# EasyEDA schematic SCH_firebase_esp8266_2024-04-16.json
TITLE: Sheet_1; REV: 1.0; Date: 2024-04-16; Sheet: 1/1; Drawn By: Trường Lê; Company: Your Company
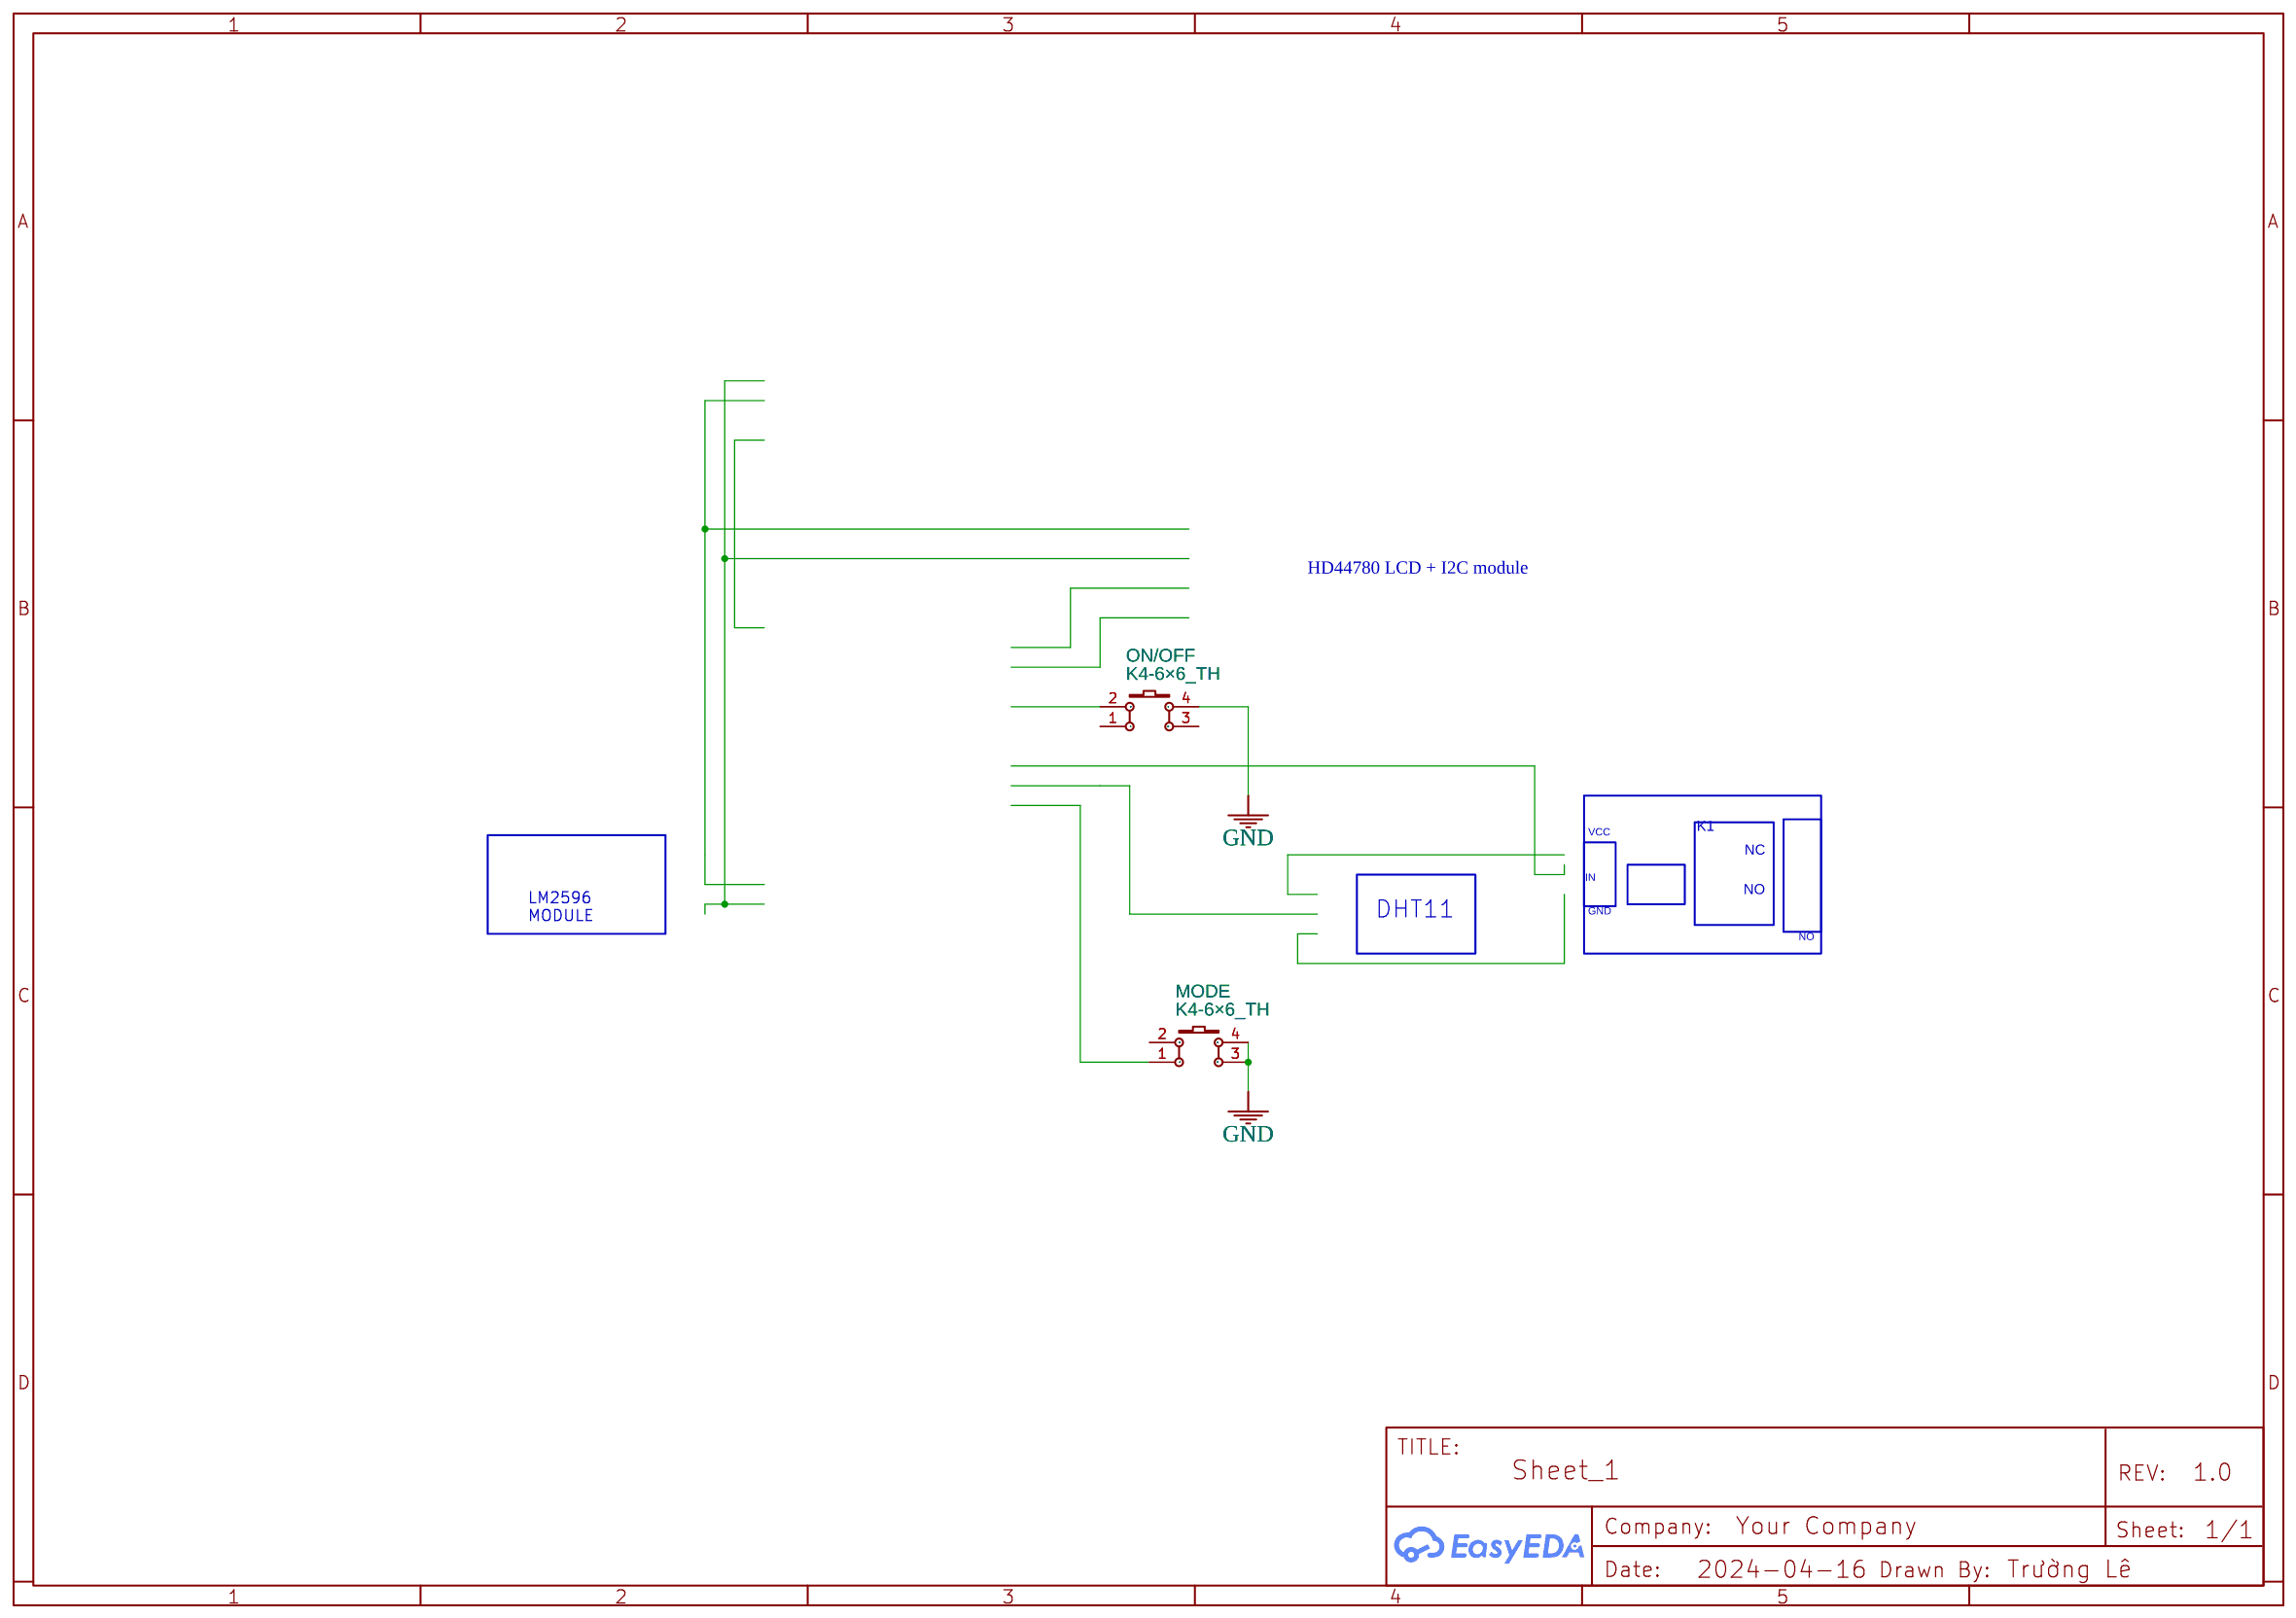
[diagram p0: schematic sheet]

## Parts
MODE  K4-6×6_TH  [KEY-TH_4P-L6.0-W6.0-P4.50-LS6.5]
ON/OFF  K4-6×6_TH  [KEY-TH_4P-L6.0-W6.0-P4.50-LS6.5]

## Library data of the parts
MODE ON/OFF = K4-6×6_TH: Supplier: LCSC; Supplier Part: C136684; Manufacturer: 韩国韩荣; Manufacturer Part: K2-1102DP-E4SW-04; Contributor: LCEDA_Lib

## Nets
GND: MODE.3 MODE.4 ON/OFF.4

Not connected (* = marked no-connect by the designer): MODE 1 2; ON/OFF 1 2 3

## Notes on the sheet
- HD44780 LCD + I2C module
- VCC
- K1
- NC
- IN
- NO
- LM2596
  MODULE
- DHT11
- GND
- NO
